# EasyEDA Pro project ProPrj_PCB_PCB_PCB_PCB_STM32F103C8T6(gift)_2023-09-09_2023-10-22_2024-01-15_2025-05-13.epro, schematic Schematic5
Create Date: 2023-11-03; Page Name: P1; Project Name: Maglev-v1; Schematic Name: Schematic5; Update Date: 2023-11-03; Company: Matrixchung; Page Size: A4; Version: V1.0
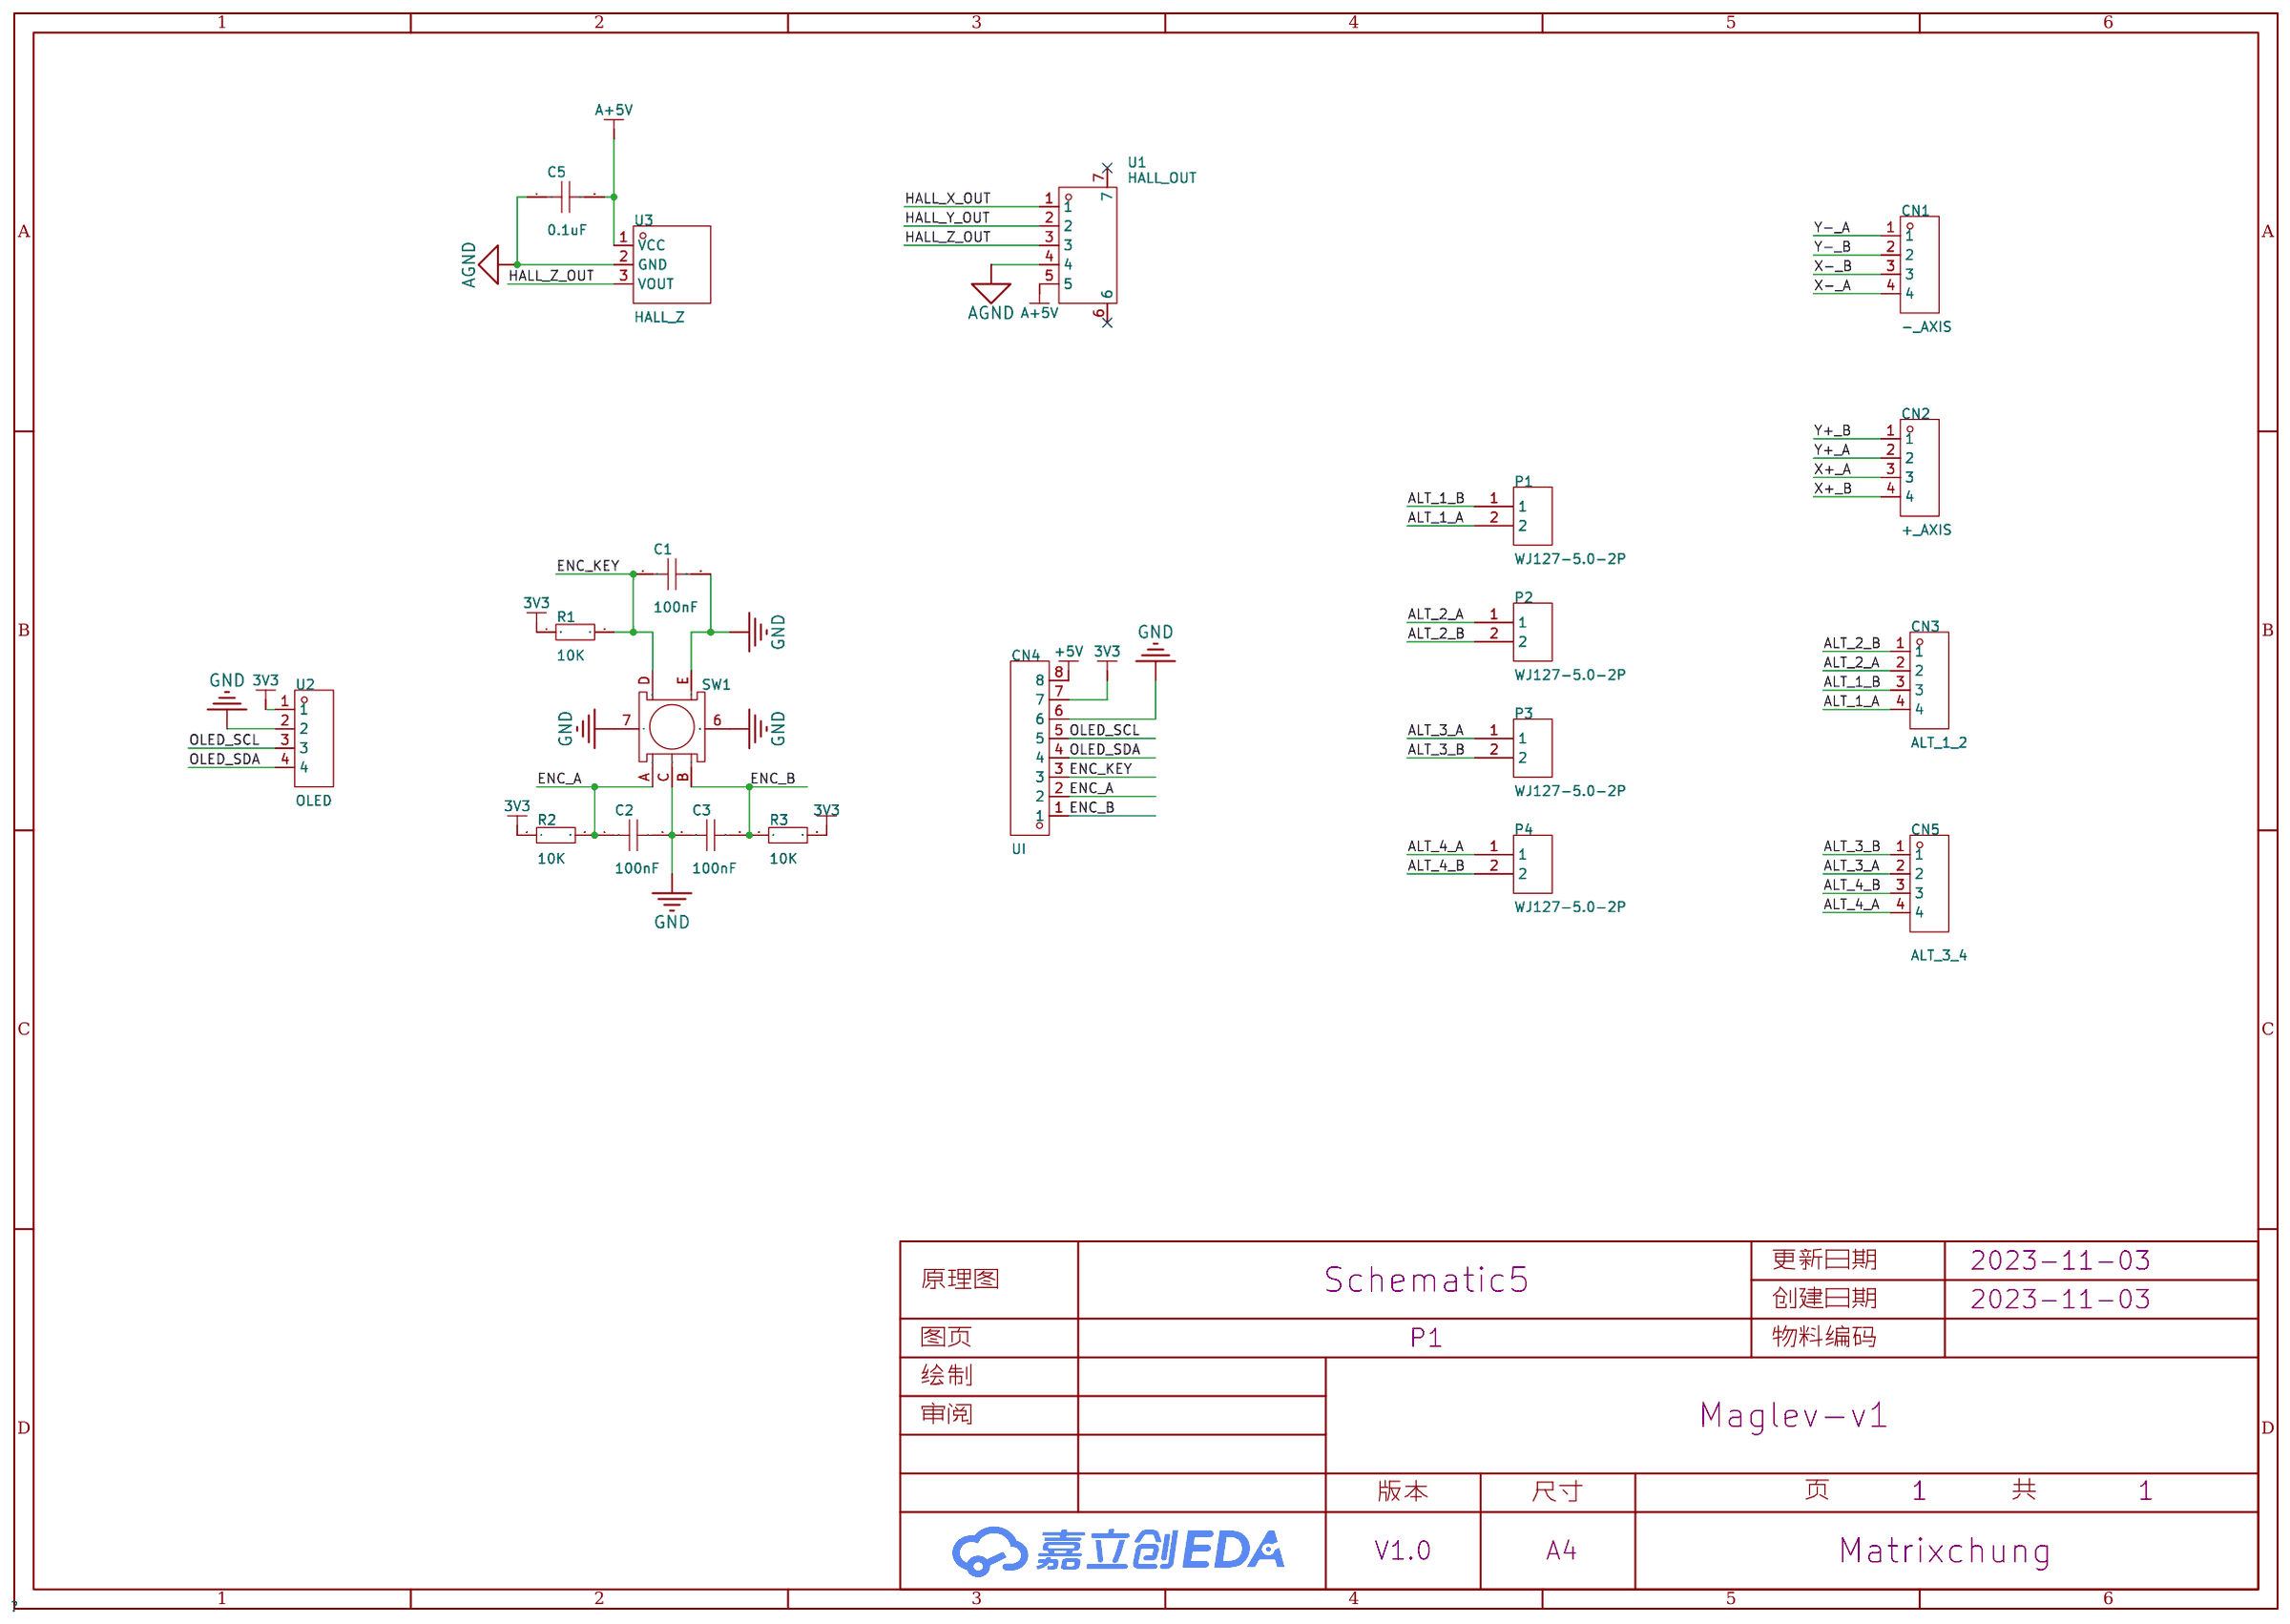
[diagram p3: schematic sheet]

## Parts
C1  100nF  [C0603]
C2  100nF  [C0603]
C3  100nF  [C0603]
C5  0.1uF  [C0603]
CN1  -_AXIS  [CONN-TH_4P-P5.00_WJ127-5.0-4P]
CN2  +_AXIS  [CONN-TH_4P-P5.00_WJ127-5.0-4P]
CN3  ALT_1_2  [CONN-TH_4P-P5.00_WJ127-5.0-4P]
CN4  UI  [CONN-TH_8P-P2.50_HCTL_HC-XHB-8A]
CN5  ALT_3_4  [CONN-TH_4P-P5.00_WJ127-5.0-4P]
P1  WJ127-5.0-2P  [CONN-TH_2P-P5.00_CPC3703CTR]
P2  WJ127-5.0-2P  [CONN-TH_2P-P5.00_CPC3703CTR]
P3  WJ127-5.0-2P  [CONN-TH_2P-P5.00_CPC3703CTR]
P4  WJ127-5.0-2P  [CONN-TH_2P-P5.00_CPC3703CTR]
R1  10K  [R0603]
R2  10K  [R0603]
R3  10K  [R0603]
SW1  -  [SW-TH_EC11XXXXXXXX]
U1  HALL_OUT  [CONN-SMD_5P-P2.50_SHOU_2.54-5PLTDK]
U2  OLED  [HDR-TH_4P-P2.54-V-F]
U3  HALL_Z  [TO-92S_L4.0-W1.52-P1.27-R]

## Library data of the parts
C1-C3 C5 = CAP_0603: Supplier Footprint: 0603
CN1-CN3 CN5 = WJ127-5.0-4P: 间距:5mm;排数:1;每排PIN数:4;安装方式:直针;额定电流:15A;额定电压:250V;线规 - AWG:14~26;线规 - mm?:1.5;工作温度范围:-40℃~+105℃;颜色:绿色;; LCSC Part Name: 5mm 排数:1 每排P数:4 直针 可拼接; Supplier Part: C192779; Manufacturer: KANGNEX(康奈克斯电气); Supplier Footprint: 直插,P=5mm; JLCPCB Part Class: Extended Part; Datasheet: https://atta.szlcsc.com/upload/public/pdf/source/20191225/C192779_DBD79F61C9FABD31EC3EFBBD98D95251.pdf; Supplier: LCSC; Pitch: 5mm; Number of Rows: 1; Number of PINs Per Row: 4; Mounting Style: 直针; Current Rating (Max): 15A; Voltage Rating (Max): 250V; Wire Gauge - AWG: 14~26; Wire Gauge - mm?: 1.5; Operating Temperature Range: -40℃~+105℃; Color: 绿色
CN4 = HC-XHB-8A: 参考系列:-;间距:2.5mm;插针结构:1x8P;排数:1;每排PIN数:8;行距:-;公母:公型插针;安装方式:直插;额定电流:3A;工作温度范围:-25℃~+85℃;; LCSC Part Name: 2.54带锁扣立式插件 8P 针座连接器线对板/线对线连接器; Supplier Part: C2845496; Manufacturer: HCTL(华灿天禄); Supplier Footprint: 插件,P=2.5mm; JLCPCB Part Class: Extended Part; Datasheet: https://atta.szlcsc.com/upload/public/pdf/source/20210728/C2845490_C6E0123D5C5ECC46C6D4C91ADB43F484.pdf; Supplier: LCSC; Pitch: 2.5mm; Pins Structure: 1x8P; Number of Rows: 1; Number of PINs Per Row: 8; Gender: 公型插针; Mounting Style: 直插; Current Rating (Max): 3A; Operating Temperature Range: -25℃~+85℃
P1-P4 = WJ127-5.0-2P: 间距:5mm;结构:1x2P;排数:1;每排PIN数:2;安装方式:直插;额定电流:15A;额定电压:250V;线规 - AWG:14~26;线规 - mm2:1.5;工作温度范围:-40℃~+105℃;颜色:绿色;; LCSC Part Name: 5mm 1x2P 排数:1 每排P数:2 直插 可拼接; Supplier Part: C3703; Manufacturer: KANGNEX(康奈克斯电气); Supplier Footprint: 插件,P=5mm; JLCPCB Part Class: 扩展库; Datasheet: https://atta.szlcsc.com/upload/public/pdf/source/20191225/C3703_1F4D1F1BB9E32B564BC518663FFF2A0C.pdf; Supplier: LCSC; Pitch: 5mm; Structure: 1x2P; Number of Rows: 1; Number of PINs Per Row: 2; Mounting Style: 直插; Current Rating (Max): 15A; Voltage Rating (Max): 250V; Wire Gauge - AWG: 14~26; Wire Gauge - mm2: 1.5; Operating Temperature Range: -40℃~+105℃; Color: 绿色; Number of Pins: 2P
R1-R3 = Res_0603: Supplier Footprint: 0603
SW1 = 旋转编码器: Supplier Part: C470754; Supplier Footprint: 插件
U1 = 2.54-5PLTDK: 间距:2.5mm;插针结构:1x5P;排数:1;每排PIN数:5;公母:公型插针;安装方式:立贴;额定电流:3A;工作温度范围:-25℃~+85℃;; LCSC Part Name: 2.5mm 1x5P 立贴 2.54间距 5P立贴 带扣; Supplier Part: C3008570; Manufacturer: SHOU HAN(首韩); Supplier Footprint: SMD,P=2.5mm; JLCPCB Part Class: 扩展库; Datasheet: https://atta.szlcsc.com/upload/public/pdf/source/20220427/9CF34F7E60AAB3960A858C15607F0738.pdf; Supplier: LCSC; Pitch: 2.5mm; Pins Structure: 1x5P; Number of Rows: 1; Number of PINs Per Row: 5; Gender: 公型插针; Mounting Style: 立贴; Current Rating (Max): 3A; Operating Temperature Range: -25℃~+85℃
U2 = PM254-1-04-Z-8.5_C2897367: 排数:单排;总孔位数:4P;间距:2.54mm;插孔结构:1x4P;行距:-;安装类型:直插;圆孔/方孔:方孔;额定电流:3A;额定电压:-;插孔方向:顶部;塑高:8.5mm;工作温度范围:-40℃~+105℃;; LCSC Part Name: 间距:2.54mm 1x4P 直插; Supplier Part: C2897367; Manufacturer: HCTL(华灿天禄); Supplier Footprint: 插件,P=2.54mm; JLCPCB Part Class: 扩展库; Datasheet: https://atta.szlcsc.com/upload/public/pdf/source/20230609/534BE42964C679BDE98E061007C4ABD6.pdf; Supplier: LCSC; Number of Rows: 单排; Number of Holes: 4P; Pitch: 2.54mm; Holes Structure: 1x4P; Mounting Type: 直插; Circular Hole / Square Hole: 方孔; Current Rating (Max): 3A; Holes Direction: 顶部; Insulation Height: 8.5mm; Operating Temperature Range: -40℃~+105℃
U3 = AH3503: 霍尔传感芯片; LCSC Part Name: 线性霍尔电路; Supplier Part: C248991; Manufacturer: 南京艾驰; Supplier Footprint: TO-92S; JLCPCB Part Class: 扩展库; Datasheet: https://atta.szlcsc.com/upload/public/pdf/source/20191017/C248991_CFC9B8AAC885FEDD87E8E3E3EB49165B.pdf; Supplier: LCSC

## Nets
3V3: CN4.7 R1.1 R2.1 R3.2 U2.1
+5V: CN4.8
AGND: C5.1 U1.4 U3.2(GND)
GND: C1.2 C2.2 C3.1 CN4.6 SW1.6 SW1.7 SW1.C SW1.E U2.2
A+5V: C5.2 U1.5 U3.1(VCC)
ALT_1_A: CN3.4 P1.2
ALT_1_B: CN3.3 P1.1
ALT_2_A: CN3.2 P2.1
ALT_2_B: CN3.1 P2.2
ALT_3_A: CN5.2 P3.1
ALT_3_B: CN5.1 P3.2
ALT_4_A: CN5.4 P4.1
ALT_4_B: CN5.3 P4.2
ENC_A: C2.1 CN4.2 R2.2 SW1.A
ENC_B: C3.2 CN4.1 R3.1 SW1.B
ENC_KEY: C1.1 CN4.3 R1.2 SW1.D
HALL_X_OUT: U1.1
HALL_Y_OUT: U1.2
HALL_Z_OUT: U1.3 U3.3(VOUT)
OLED_SCL: CN4.5 U2.3
OLED_SDA: CN4.4 U2.4
X+_A: CN2.3
X+_B: CN2.4
X-_A: CN1.4
X-_B: CN1.3
Y+_A: CN2.2
Y+_B: CN2.1
Y-_A: CN1.1
Y-_B: CN1.2

Not connected (* = marked no-connect by the designer): U1 6* 7*
